# EAGLE design combined (EAGLE 8.6.0)

## Sheet 1 of 6
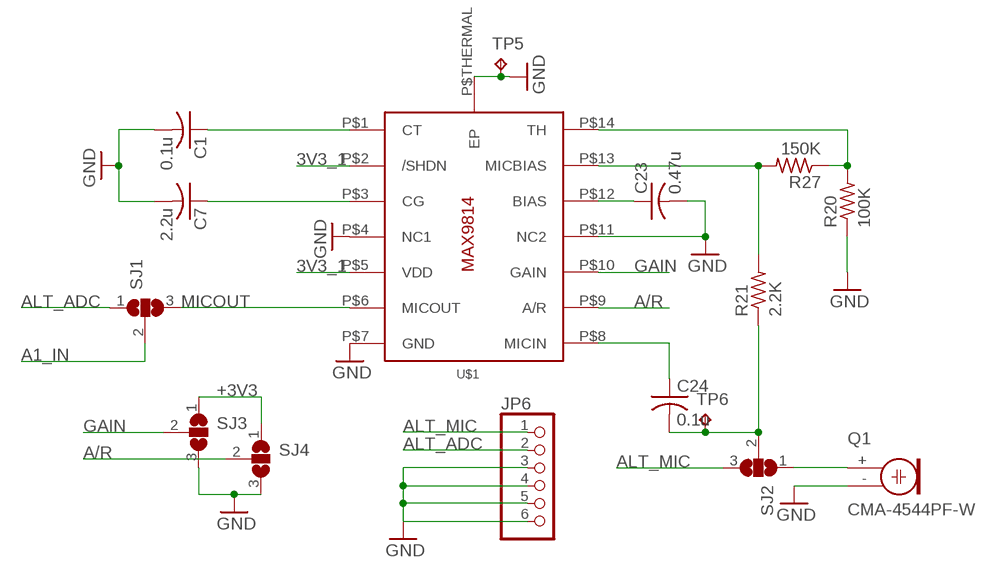
[diagram p0: schematic, sheet 1]

### Parts
C1  0.1u  C-USC0603  [C0603]
C7  2.2u  C-USC0603  [C0603]
C23  0.47u  C-USC0603  [C0603]
C24  0.1u  C-USC0603  [C0603]
JP6  PINHD-1X6  [1X06]
Q1  CMA-4544PF-W  ELECTRET  [9.7ELECTRET]
R20  100K  R-US_R0603  [R0603]
R21  2.2K  R-US_R0603  [R0603]
R27  150K  R-US_R0603  [R0603]
SJ1  SJ2W  [SJ_2]
SJ2  SJ2W  [SJ_2]
SJ3  SJ2W  [SJ_2]
SJ4  SJ2W  [SJ_2]
TP5  TPB1,27  [B1,27]
TP6  TPB1,27  [B1,27]
U$1  MAX9814TDFN14  [TDFN14_3X3MM]

### Nets
3V3_1: U$1.P$2(/SHDN) U$1.P$5(VDD)
+3V3: SJ3.1 SJ4.1 ; also sheet 3,4,5,6
A1_IN: SJ1.2 ; also sheet 3
A/R: SJ4.2 U$1.P$9(A/R)
ALT_ADC: JP6.2 SJ1.1
ALT_MIC: JP6.1
GAIN: SJ3.2 U$1.P$10(GAIN)
GND: C1.2 C7.2 C23.2 Q1.- R20.1 SJ3.3 SJ4.3 TP5.TP U$1.P$4(NC1) U$1.P$7(GND) U$1.P$11(NC2) U$1.P$THERMAL(EP) ; also sheet 2,3,4,5,6
INPUT: C24.2 R21.1 SJ2.2 TP6.TP
MICOUT: SJ1.3 U$1.P$6(MICOUT)
N$5: C24.1 U$1.P$8(MICIN)
N$7: C23.1 U$1.P$12(BIAS)
N$8: C1.1 U$1.P$1(CT)
N$9: C7.1 U$1.P$3(CG)
N$10: R20.2 R27.1 U$1.P$14(TH)
N$11: R21.2 R27.2 U$1.P$13(MICBIAS)
N$33: Q1.+ SJ2.1
N$47: JP6.3 JP6.4 JP6.5 JP6.6
Unconnected: SJ2.3

## Sheet 2 of 6
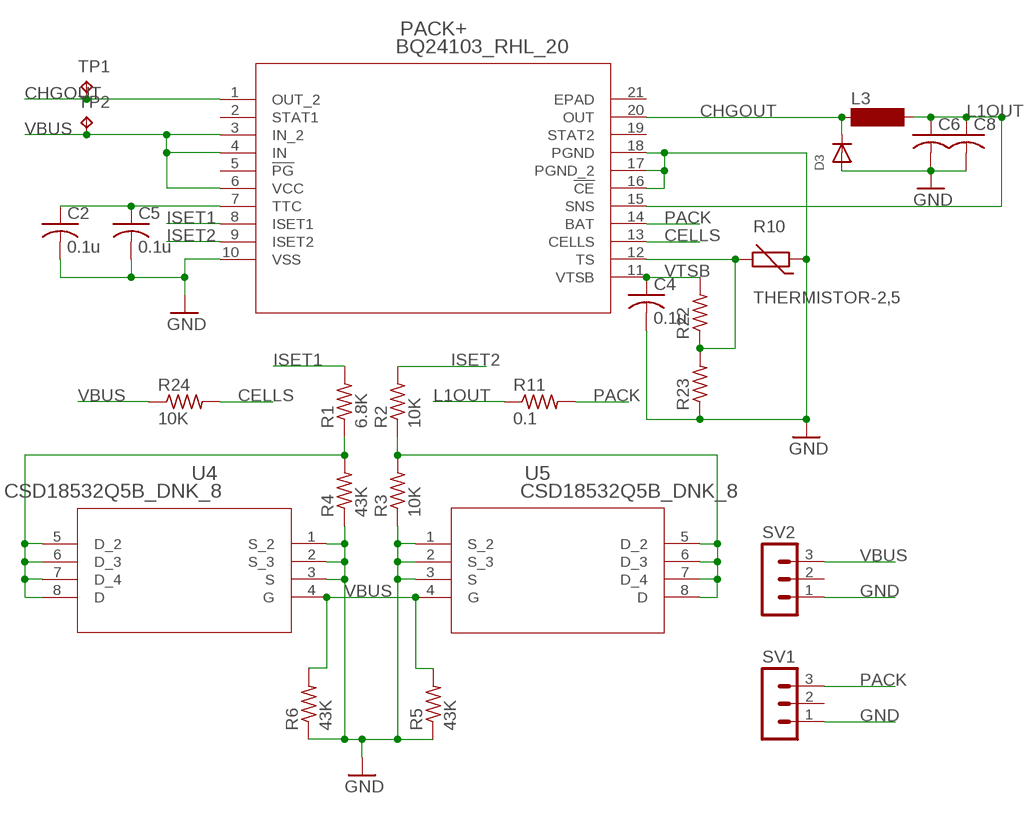
[diagram p1: schematic, sheet 2]

### Parts
C2  0.1u  C-USC0603  [C0603]
C4  0.1u  C-USC0603  [C0603]
C5  0.1u  C-USC0603  [C0603]
C6  C-USC0805K  [C0805K]
C8  C-USC0805K  [C0805K]
D3  DIODESOD-323F  [SOD-323F]
L3  MS85  [MS85]
PACK+  BQ24103_RHL_20  [RHL20_2P05X3P05]
R1  6.8K  R-US_R0603  [R0603]
R2  10K  R-US_R0603  [R0603]
R3  10K  R-US_R0603  [R0603]
R4  43K  R-US_R0603  [R0603]
R5  43K  R-US_R0603  [R0603]
R6  43K  R-US_R0603  [R0603]
R10  THERMISTOR-2,5  [RS-2,5]
R11  0.1  R-US_R0805  [R0805]
R22  R-US_R0805  [R0805]
R23  R-US_R0805  [R0805]
R24  10K  R-US_R0805  [R0805]
SV1  MA03-1  [MA03-1]
SV2  MA03-1  [MA03-1]
TP1  TPB1,27  [B1,27]
TP2  TPB1,27  [B1,27]
U4  CSD18532Q5B_DNK_8  [DNK8]
U5  CSD18532Q5B_DNK_8  [DNK8]

### Nets
CELLS: PACK+.13(CELLS) R24.2
CHGOUT: D3.C L3.1 PACK+.1(OUT_2) PACK+.20(OUT) TP1.TP
GND: C2.2 C4.2 C5.2 C6.2 C8.2 D3.A PACK+.10(VSS) PACK+.16(!CE) PACK+.17(PGND_2) PACK+.18(PGND) R3.1 R4.1 R5.1 R6.1 R10.1 R23.1 SV1.1 SV2.1 U4.1(S_2) U4.2(S_3) U4.3(S) U5.1(S_2) U5.2(S_3) U5.3(S) ; also sheet 1,3,4,5,6
ISET1: PACK+.8(ISET1) R1.2
ISET2: PACK+.9(ISET2) R2.2
L1OUT: C6.1 C8.1 L3.2 PACK+.15(SNS) R11.1
N$22: C2.1 C5.1 PACK+.7(TTC)
N$23: PACK+.12(TS) R10.2 R22.1 R23.2
N$24: R1.1 R4.2 U4.5(D_2) U4.6(D_3) U4.7(D_4) U4.8(D)
N$26: R2.1 R3.2 U5.5(D_2) U5.6(D_3) U5.7(D_4) U5.8(D)
PACK: PACK+.14(BAT) R11.2 SV1.3 ; also sheet 6
VBUS: PACK+.3(IN_2) PACK+.4(IN) PACK+.6(VCC) R5.2 R6.2 R24.1 SV2.3 TP2.TP U4.4(G) U5.4(G) ; also sheet 4
VTSB: C4.1 PACK+.11(VTSB) R22.2
Unconnected: PACK+.2(STAT1) PACK+.5(!PG) PACK+.19(STAT2) PACK+.21(EPAD) SV1.2 SV2.2

## Sheet 3 of 6
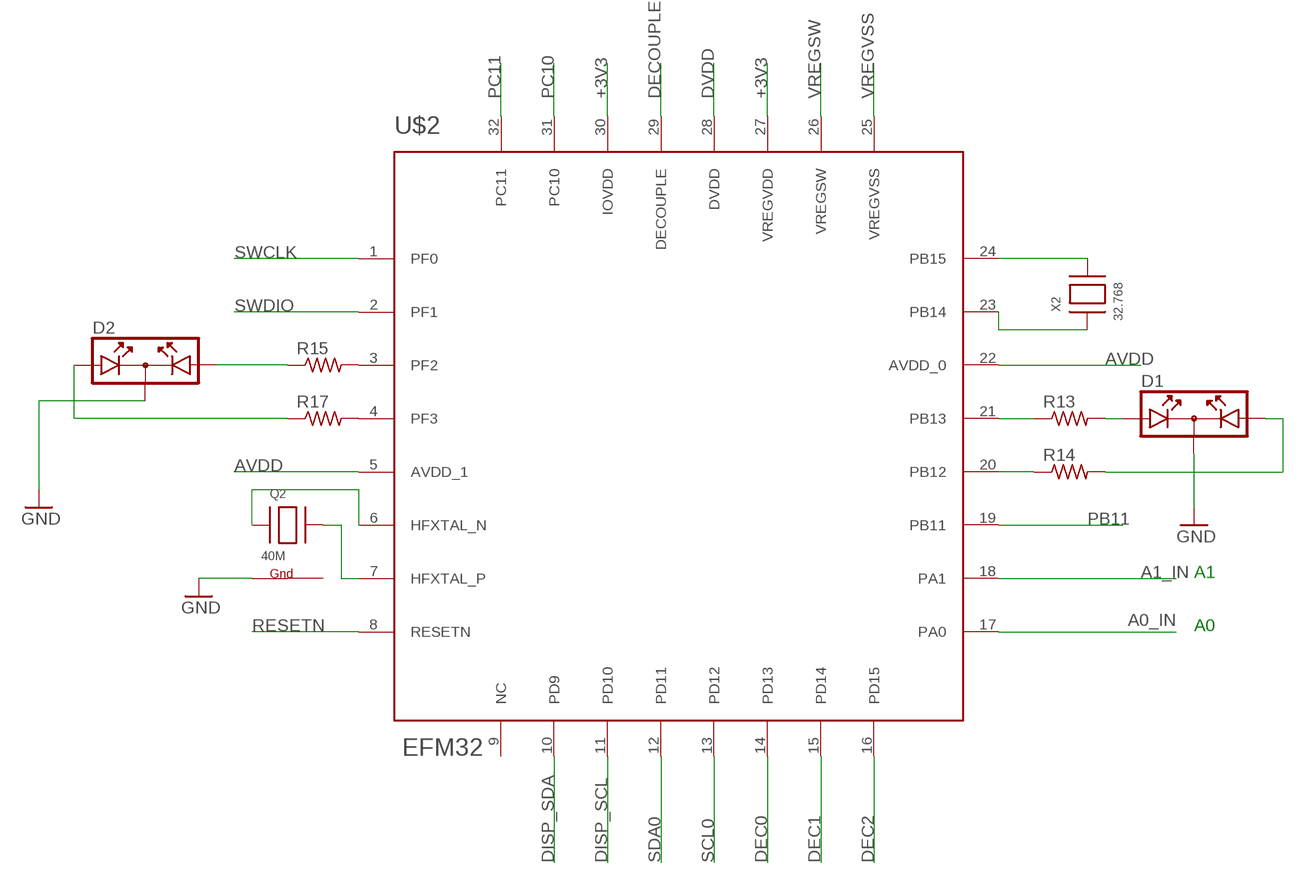
[diagram p2: schematic, sheet 3]

### Parts
D1  DUOLED  [DUOLED]
D2  DUOLED  [DUOLED]
Q2  40M  XTAL-4-3225  [NX3225]
R13  R-US_M0805  [M0805]
R14  R-US_M0805  [M0805]
R15  R-US_M0805  [M0805]
R17  R-US_M0805  [M0805]
U$2  EFM32  [QFN32]
X2  32.768  XTAL-3.2X1.5  [XTAL3215]

### Nets
+3V3: U$2.27(VREGVDD) U$2.30(IOVDD) ; also sheet 1,4,5,6
A0_IN: U$2.17(PA0)
A1_IN: U$2.18(PA1) ; also sheet 1
AVDD: U$2.5(AVDD_1) U$2.22(AVDD_0) ; also sheet 5
DEC0: U$2.14(PD13) ; also sheet 4
DEC1: U$2.15(PD14) ; also sheet 4
DEC2: U$2.16(PD15) ; also sheet 4
DECOUPLE: U$2.29(DECOUPLE) ; also sheet 5
DISP_SCL: U$2.11(PD10) ; also sheet 4
DISP_SDA: U$2.10(PD9) ; also sheet 4
DVDD: U$2.28(DVDD) ; also sheet 5
GND: D1.K D2.K Q2.4(G1) ; also sheet 1,2,4,5,6
N$32: Q2.1(X1) U$2.6(HFXTAL_N)
N$34: Q2.3(X2) U$2.7(HFXTAL_P)
N$35: U$2.24(PB15) X2.P$2
N$36: U$2.23(PB14) X2.P$1
N$37: D1.A1 R13.2
N$38: D1.A2 R14.2
N$40: R15.2 U$2.3(PF2)
N$41: D2.A2 R15.1
N$42: R17.2 U$2.4(PF3)
N$43: D2.A1 R17.1
N$44: R14.1 U$2.20(PB12)
N$45: R13.1 U$2.21(PB13)
PB11: U$2.19(PB11) ; also sheet 4,6
PC10: U$2.31(PC10) ; also sheet 4
PC11: U$2.32(PC11) ; also sheet 4
RESETN: U$2.8(RESETN)
SCL0: U$2.13(PD12) ; also sheet 4
SDA0: U$2.12(PD11) ; also sheet 4
SWCLK: U$2.1(PF0) ; also sheet 4
SWDIO: U$2.2(PF1) ; also sheet 4
VREGSW: U$2.26(VREGSW) ; also sheet 5
VREGVSS: U$2.25(VREGVSS)
Unconnected: U$2.9(NC)

### Notes on the sheet
- A1
- A0

## Sheet 4 of 6
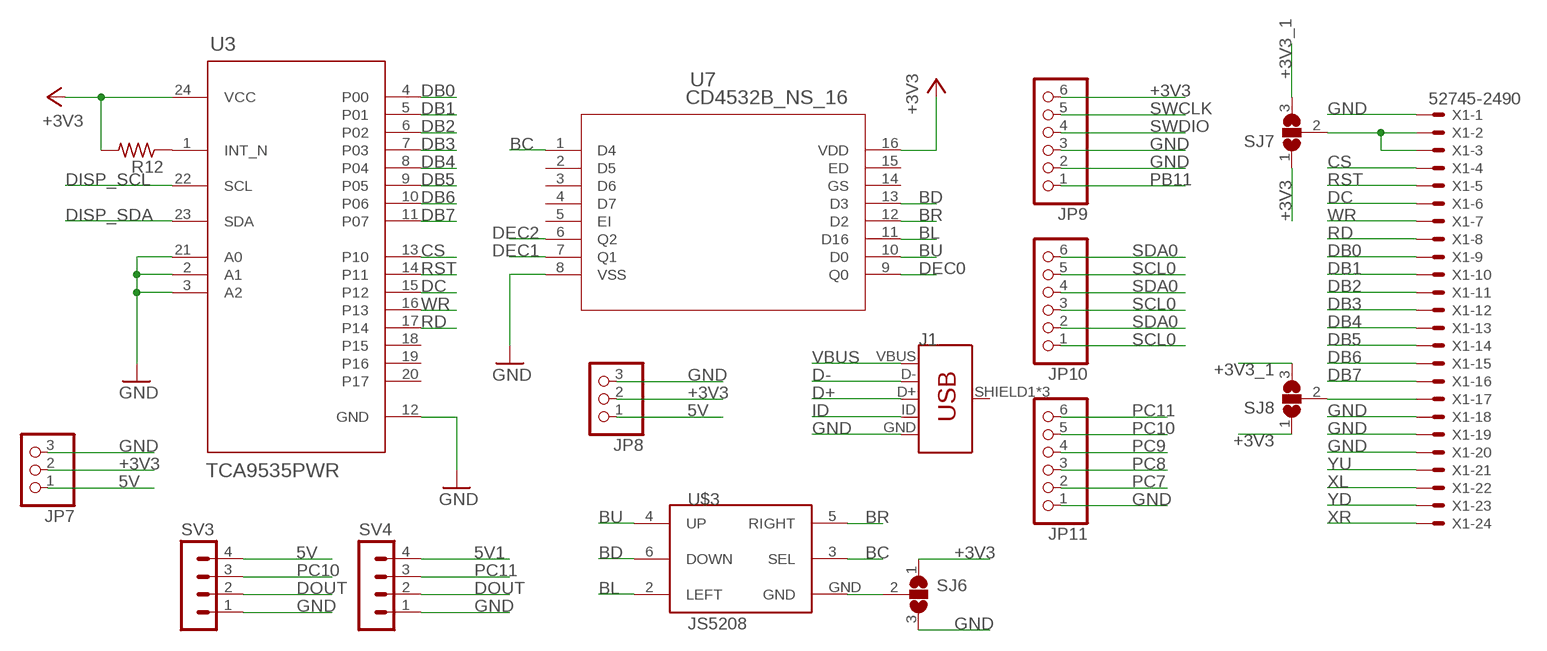
[diagram p3: schematic, sheet 4]

### Parts
J1  USB_MICRO-B_FEMALE-SMT  [USB-B-MICRO-SMD]
JP7  PINHD-1X3  [1X03]
JP8  PINHD-1X3  [1X03]
JP9  PINHD-1X6  [1X06]
JP10  PINHD-1X6  [1X06]
JP11  PINHD-1X6  [1X06]
R12  R-US_M0805  [M0805]
SJ6  SJ2W  [SJ_2]
SJ7  SJ2W  [SJ_2]
SJ8  SJ2W  [SJ_2]
SV3  MA04-1  [MA04-1]
SV4  MA04-1  [MA04-1]
U3  TCA9535PWR  [PW0024A_N]
U7  CD4532B_NS_16  [NS16]
U$3  JS5208  [JS5208]
X1  52745-2490  [52745-2490]

### Nets
5V: JP7.1 JP8.1 SV3.4 ; also sheet 6
5V1: SV4.4 ; also sheet 6
+3V3: JP7.2 JP8.2 JP9.6 R12.2 SJ6.1 SJ7.1 SJ8.1 U3.24(VCC) U7.16(VDD) ; also sheet 1,3,5,6
+3V3_1: SJ7.3 SJ8.3 ; also sheet 6
BC: U7.1(D4) U$3.3(SEL)
BD: U7.13(D3) U$3.6(DOWN)
BL: U7.11(D16) U$3.2(LEFT)
BR: U7.12(D2) U$3.5(RIGHT)
BU: U7.10(D0) U$3.4(UP)
CS: U3.13(P10) X1.4
D+: J1.D+
D-: J1.D-
DB0: U3.4(P00) X1.9
DB1: U3.5(P01) X1.10
DB2: U3.6(P02) X1.11
DB3: U3.7(P03) X1.12
DB4: U3.8(P04) X1.13
DB5: U3.9(P05) X1.14
DB6: U3.10(P06) X1.15
DB7: U3.11(P07) X1.16
DC: U3.15(P12) X1.6
DEC0: U7.9(Q0) ; also sheet 3
DEC1: U7.7(Q1) ; also sheet 3
DEC2: U7.6(Q2) ; also sheet 3
DISP_SCL: U3.22(SCL) ; also sheet 3
DISP_SDA: U3.23(SDA) ; also sheet 3
DOUT: SV3.2 SV4.2
GND: J1.GND JP7.3 JP8.3 JP9.2 JP9.3 JP11.1 SJ6.3 SV3.1 SV4.1 U3.2(A1) U3.3(A2) U3.12(GND) U3.21(A0) U7.8(VSS) X1.1 X1.18 X1.19 X1.20 ; also sheet 1,2,3,5,6
ID: J1.ID
N$1: SJ7.2 X1.2 X1.3
N$6: SJ8.2 X1.17
N$16: SJ6.2 U$3.GND
N$46: R12.1 U3.1(INT_N)
PB11: JP9.1 ; also sheet 3,6
PC7: JP11.2
PC8: JP11.3
PC9: JP11.4
PC10: JP11.5 SV3.3 ; also sheet 3
PC11: JP11.6 SV4.3 ; also sheet 3
RD: U3.17(P14) X1.8
RST: U3.14(P11) X1.5
SCL0: JP10.1 JP10.3 JP10.5 ; also sheet 3
SDA0: JP10.2 JP10.4 JP10.6 ; also sheet 3
SWCLK: JP9.5 ; also sheet 3
SWDIO: JP9.4 ; also sheet 3
VBUS: J1.VBUS ; also sheet 2
WR: U3.16(P13) X1.7
XL: X1.22
XR: X1.24
YD: X1.23
YU: X1.21
Unconnected: J1.SHIELD1(SHIELD) J1.SHIELD2(SHIELD) J1.SHIELD3(SHIELD) U3.18(P15) U3.19(P16) U3.20(P17) U7.2(D5) U7.3(D6) U7.4(D7) U7.5(EI) U7.14(GS) U7.15(ED)

## Sheet 5 of 6
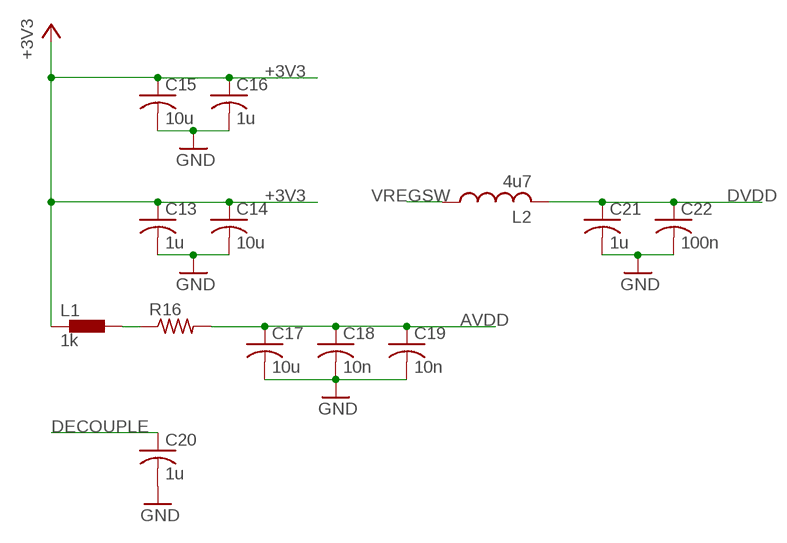
[diagram p4: schematic, sheet 5]

### Parts
C13  1u  C-USC0805  [C0805]
C14  10u  C-USC0805  [C0805]
C15  10u  C-USC0805  [C0805]
C16  1u  C-USC0805  [C0805]
C17  10u  C-USC0805  [C0805]
C18  10n  C-USC0805  [C0805]
C19  10n  C-USC0805  [C0805]
C20  1u  C-USC0805  [C0805]
C21  1u  C-USC0805  [C0805]
C22  100n  C-USC0805  [C0805]
L1  1k  BLM15HD102SN1  [0402]
L2  4u7  L-USL3225P  [L3225P]
R16  R-US_R0603  [R0603]

### Nets
+3V3: C13.1 C14.1 C15.1 C16.1 L1.1 ; also sheet 1,3,4,6
AVDD: C17.1 C18.1 C19.1 R16.2 ; also sheet 3
DECOUPLE: C20.1 ; also sheet 3
DVDD: C21.1 C22.1 L2.2 ; also sheet 3
GND: C13.2 C14.2 C15.2 C16.2 C17.2 C18.2 C19.2 C20.2 C21.2 C22.2 ; also sheet 1,2,3,4,6
N$2: L1.2 R16.1
VREGSW: L2.1 ; also sheet 3

## Sheet 6 of 6
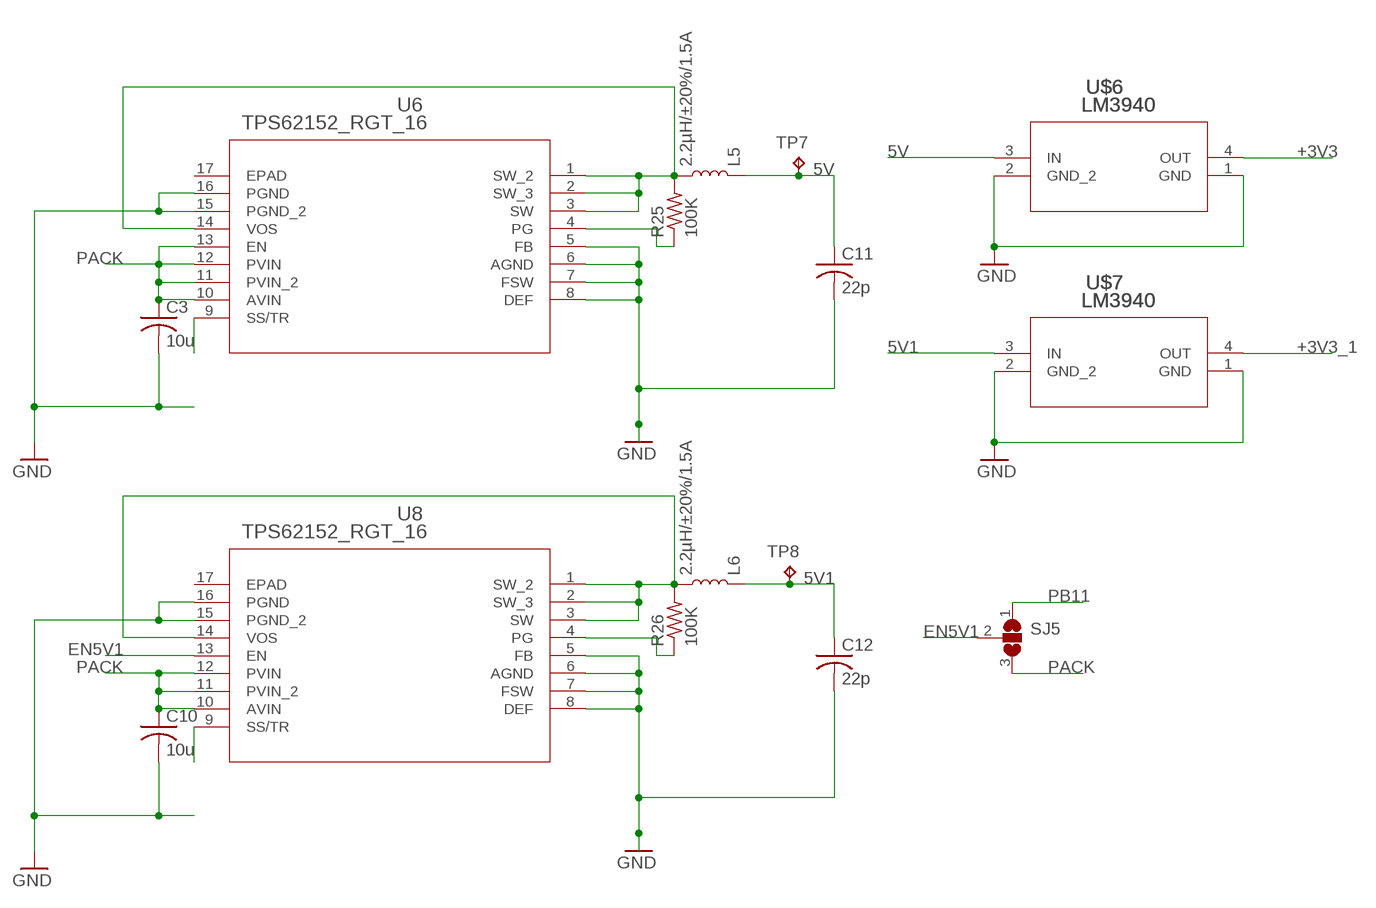
[diagram p5: schematic, sheet 6]

### Parts
C3  10u  C-USC0603K  [C0603K]
C10  10u  C-USC0603K  [C0603K]
C11  22p  C-USC0603K  [C0603K]
C12  22p  C-USC0603K  [C0603K]
L5  2.2µH/±20%/1.5A  INDUCTOR-VLF4012AT-2.2UH  [INDUCTOR_2.2UH]
L6  2.2µH/±20%/1.5A  INDUCTOR-VLF4012AT-2.2UH  [INDUCTOR_2.2UH]
R25  100K  R-US_R0603  [R0603]
R26  100K  R-US_R0603  [R0603]
SJ5  SJ2W  [SJ_2]
TP7  TPB1,27  [B1,27]
TP8  TPB1,27  [B1,27]
U6  TPS62152_RGT_16  [RGT16_1P7X1P7]
U8  TPS62152_RGT_16  [RGT16_1P7X1P7]
U$6  LM3940  [MP04A]
U$7  LM3940  [MP04A]

### Nets
5V: C11.1 L5.P$1 TP7.TP U$6.3(IN) ; also sheet 4
5V1: C12.1 L6.P$1 TP8.TP U$7.3(IN) ; also sheet 4
+3V3: U$6.4(OUT) ; also sheet 1,3,4,5
+3V3_1: U$7.4(OUT) ; also sheet 4
EN5V1: SJ5.2 U8.13(EN)
GND: C3.2 C10.2 C11.2 C12.2 U6.5(FB) U6.6(AGND) U6.7(FSW) U6.8(DEF) U6.15(PGND_2) U6.16(PGND) U8.5(FB) U8.6(AGND) U8.7(FSW) U8.8(DEF) U8.15(PGND_2) U8.16(PGND) U$6.1(GND) U$6.2(GND_2) U$7.1(GND) U$7.2(GND_2) ; also sheet 1,2,3,4,5
N$3: U8.9(SS/TR)
N$4: U6.9(SS/TR)
N$48: L5.P$2 R25.2 U6.1(SW_2) U6.2(SW_3) U6.3(SW) U6.14(VOS)
N$53: R25.1 U6.4(PG)
N$54: L6.P$2 R26.2 U8.1(SW_2) U8.2(SW_3) U8.3(SW) U8.14(VOS)
N$55: R26.1 U8.4(PG)
PACK: C3.1 C10.1 SJ5.3 U6.10(AVIN) U6.11(PVIN_2) U6.12(PVIN) U6.13(EN) U8.10(AVIN) U8.11(PVIN_2) U8.12(PVIN) ; also sheet 2
PB11: SJ5.1 ; also sheet 3,4
Unconnected: U6.17(EPAD) U8.17(EPAD)

## Power pins joined to a net without a drawn wire
G2: Q2.2(G2)

## Library data of the parts
C1-C8 C10-C24 = resistor:C-US: CAPACITOR, American symbol
D1 D2 = special:DUOLED: Duo LED
D3 = adafruit:DIODE: Diode SMADIODE - SMA Surface Mount Package 20V 1A Schottky Diode Digikey: 641-1014-6-ND DO-1N4148 - Through Hole Small Current Diode SOD-123 20V 1 A (.5mV Vf) Schottky Diode - Digikey: MBRX120TPMSCT-ND SOD-323 10V 570mA (.38mV Vf, 3ns) Schottky Diode - Digikey: ZLLS410CT-ND SOD-523 30V 30mA Schottky Diode (RB751S-40TE61) - Digikey: RB751S-40TE61CT-ND SOT23-R/W - SOT23 Package (R = Solder Paste/Reflow Ovens, W = Hand-Soldering) BAT54Film 40V 300mA - Digikey: 497-7162-1-ND
J1 = power_module:USB_MICRO-B: USB Type Micro-B Connector Male/female and PTH/SMT variants SparkFun Products: SparkFun microB USB Breakout <https://www.sparkfun.com/products/12035> SparkFun USB microB Plug Breakout <https://www.sparkfun.com/products/10031> SparkFun ESP8266 Thing <https://www.sparkfun.com/products/13231>; PROD_ID: CONN-11752
JP6 JP9-JP11 = adafruit:PINHD-1X6: PIN HEADER
JP7 JP8 = adafruit:PINHD-1X3: PIN HEADER
L1 = inductors:BLM15H: EMIFIL (R) Chip Ferrite Bead for GHz Noise Source: http://www.murata.com/ Ferrite Bead BLM15H.pdf
L2 = resistor:L-US: INDUCTOR, American symbol
L3 = inductor-neosid:MS85: INDUCTOR SMD power inductor; OC_FARNELL: unknown; OC_NEWARK: unknown
L5 L6 = power_module:INDUCTOR: Inductors Resist changes in electrical current. Basically a coil of wire. SparkFun Products: SparkFun Load Cell Amplifier - HX711 <https://www.sparkfun.com/products/13879> IOIO-OTG - V2.2 <https://www.sparkfun.com/products/13613>; PROD_ID: NDUC-09513
PACK+ = power_module:BQ24103_RHL_20
Q1 = adafruit:ELECTRET: Electret microphone Thru hole 2.54mm spacing with 9.7mm diameter
Q2 = adafruit:XTAL-4: Classic 4-pin 3.2 x 2.5mm crystal
R1-R6 R11 R16 R20-R27 = resistor:R-US_: RESISTOR, American symbol
R10 = varistor:THERMISTOR: THERMISTOR
R12-R15 R17 = adafruit:R-US_: RESISTOR, American symbol
SJ1-SJ8 = jumper:SJ2W: SMD solder JUMPER
SV1 SV2 = con-lstb:MA03-1: PIN HEADER; OC_FARNELL: unknown; OC_NEWARK: unknown
SV3 SV4 = con-lstb:MA04-1: PIN HEADER; OC_FARNELL: unknown; OC_NEWARK: unknown
TP1 TP2 TP5-TP8 = testpad:TP: Test pad
U3 = power_module:TCA9535PWR
U4 U5 = power_module:CSD18532Q5B_DNK_8; MANUFACTURER_PART_NUMBER: csd18532q5b_dnk_8; VENDOR: TEXAS INSTRUMENTS
U6 U8 = power_module:TPS62152_RGT_16; MANUFACTURER_PART_NUMBER: tps62152_rgt_16; VENDOR: Texas Instruments
U7 = power_module:CD4532B_NS_16
U$1 = adafruit:MAX9814
U$2 = QFN32:EFM32
U$3 = power_module:JS5208
U$6 U$7 = power_module:LM3940
X1 = con-molex:52745-2490: FFC/FPC-to-Board 0.50mm (.020") SMT Top Contact Right Angle, ZIF, Style Receptacle 52745 / 52435 Source: http://www.molex.com/product/ffc/52745.html; MF: MOLEX; OC_FARNELL: unknown; OC_NEWARK: unknown
X2 = adafruit:XTAL: Low cost SMT crystals, no capacitors included http://www.ladyada.net/library/eagle

## Board
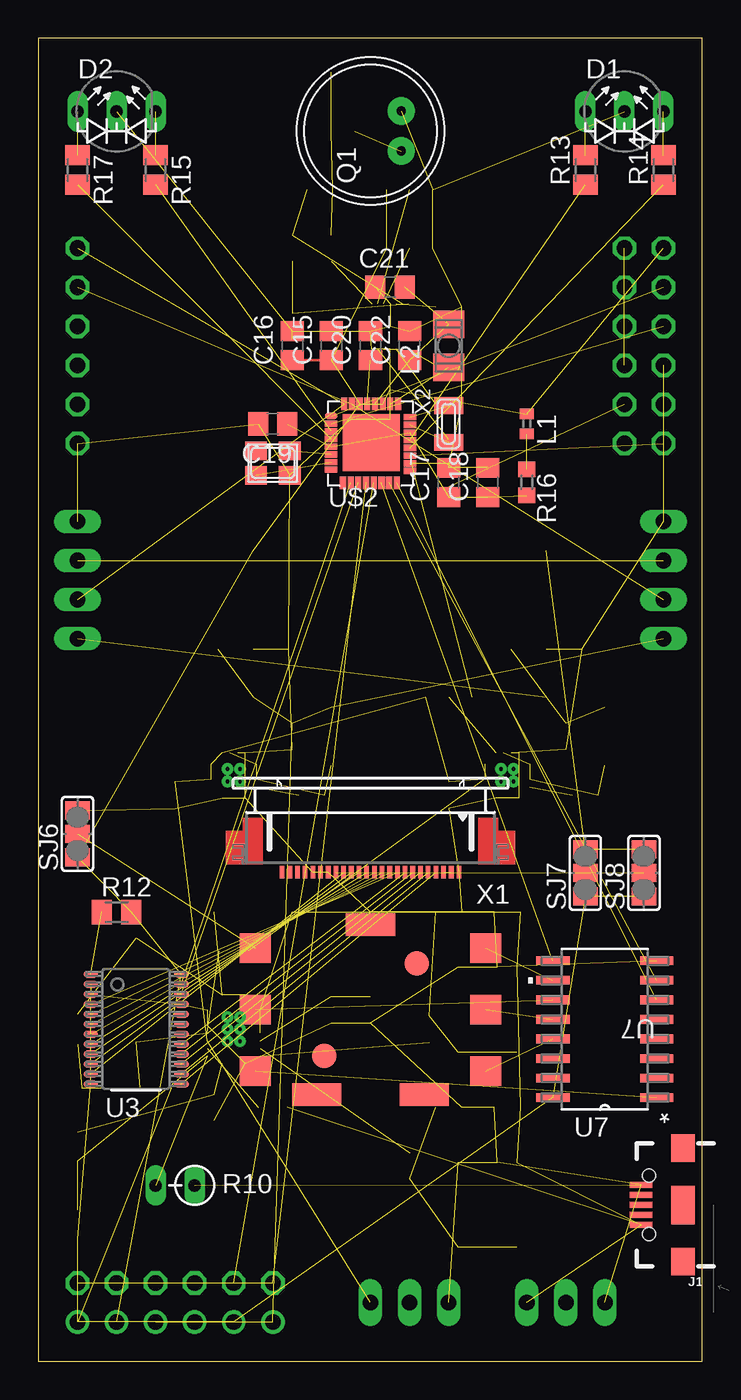
[diagram p6: board, top side]
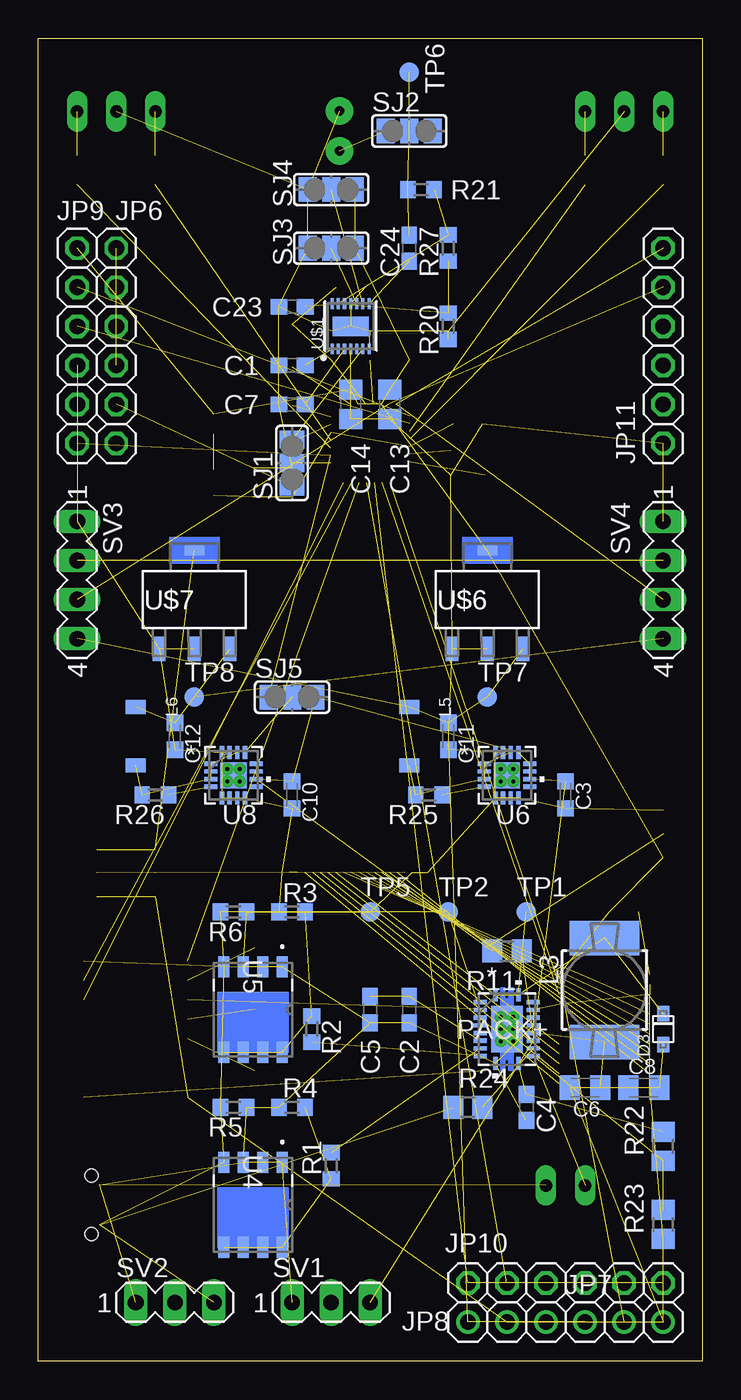
[diagram p7: board, bottom side, seen from below]

Size 43.16 x 86.03 mm. Coordinates in mm from the lower left corner, seen from the top.
Outline: 0,0 43.16,0 43.16,86.03 0,86.03 0,0
Copper layers (1*16): Top 0.035mm / dielectric 1.5mm / Bottom 0.035mm
Design rules "default": minimum track width 6mil, minimum drill 0.35mm, track to track 6mil, track to pad 6mil, pad to pad 6mil, via to via 6mil, smd to smd 6mil, copper to edge 40mil, drill to drill 6mil, minimum pad ring 10mil, minimum via ring 8mil, stop-mask expansion 4mil, vias tented up to drill 0mil, thermal gap 10mil

### Footprints (pad centres in the part's own frame; a part is rotated, then mirrored left to right if it is on the bottom)
C0603 = smd 1.1 x 1: 1 -0.85,0; 2 0.85,0
C0603K = smd 1.05 x 1.08: 1 -0.875,0; 2 0.875,0
C0805K = smd 1.3 x 1.6: 1 -1,0; 2 1,0
C0805 = smd 1.3 x 1.5: 1 -0.95,0; 2 0.95,0
DUOLED = drill 0.813 long: A1 -3.81,0; A2 1.27,0; K -1.27,0
SOD-323F = smd 1 x 0.8: A -1,0; C 1,0
USB-B-MICRO-SMD = smd 1.45 x 0.4: D+ 2.725,0; D- 2.725,0.65; GND 2.725,-1.3; ID 2.725,-0.65; VBUS 2.725,1.3 | smd 1.5 x 1.8: SHIELD1 0,3.685; SHIELD2 0,-3.685 | smd 1.5 x 2.5: SHIELD3 0,0 | hole 0.85: 2.2,1.9; 2.2,-1.9
1X06 = drill 1.016 octagon: 1 -6.35,0; 2 -3.81,0; 3 -1.27,0; 4 1.27,0; 5 3.81,0; 6 6.35,0
1X03 = drill 1.016: 1 -2.54,0; 2 0,0; 3 2.54,0
0402 = smd 0.7 x 0.9: 1 -0.65,0; 2 0.65,0
L3225P = smd 1.8 x 2: 1 -1.4,0; 2 1.4,0
MS85 = smd 4.5 x 2.25: 1 0,-3.383; 2 0,3.383
INDUCTOR_2.2UH = smd 0.9 x 1.3: P$1 -1.9,0; P$2 1.9,0
RHL20_2P05X3P05 = smd 0.28 x 0.85: 1 -0.75,2.225; 10 -0.75,-2.225; 11 0.75,-2.225; 20 0.75,2.225 | smd 0.85 x 0.28: 2 -1.725,1.75; 3 -1.725,1.25; 4 -1.725,0.75; 5 -1.725,0.25; 6 -1.725,-0.25; 7 -1.725,-0.75; 8 -1.725,-1.25; 9 -1.725,-1.75; 12 1.725,-1.75; 13 1.725,-1.25; 14 1.725,-0.75; 15 1.725,-0.25; 16 1.725,0.25; 17 1.725,0.75; 18 1.725,1.25; 19 1.725,1.75 | smd 2.05 x 3.05: 21 0,0 | drill 0.254 pad 0.508: V -0.406,-0.787; V_1 -0.406,0; V_2 -0.406,0.787; V_3 0.406,-0.787; V_4 0.406,0; V_5 0.406,0.787
9.7ELECTRET = drill 0.6 pad 1.778: + 1.3,2; - -1.3,2
NX3225 = smd 1.4 x 1.2: 1 -1.1,-0.8; 2 1.1,-0.8; 3 1.1,0.8; 4 -1.1,0.8
R0603 = smd 1 x 1.1: 1 -0.85,0; 2 0.85,0
RS-2,5 = drill 0.813 long: 1 -1.27,0; 2 1.27,0
R0805 = smd 1.3 x 1.5: 1 -0.95,0; 2 0.95,0
M0805 = smd 1.3 x 1.6: 1 -0.95,0; 2 0.95,0
SJ_2 = smd 1.168 x 1.6: 1 -1.524,0; 2 0,0; 3 1.524,0
MA03-1 = drill 1.016 long: 1 -2.54,0; 2 0,0; 3 2.54,0
MA04-1 = drill 1.016 long: 1 -3.81,0; 2 -1.27,0; 3 1.27,0; 4 3.81,0
B1,27 = smd 1.27 x 1.27: TP 0,0
PW0024A_N = smd 0.95 x 0.45: 1 -2.95,3.575; 2 -2.95,2.925; 3 -2.95,2.275; 4 -2.95,1.625; 5 -2.95,0.975; 6 -2.95,0.325; 7 -2.95,-0.325; 8 -2.95,-0.975; 9 -2.95,-1.625; 10 -2.95,-2.275; 11 -2.95,-2.925; 12 -2.95,-3.575; 13 2.95,-3.575; 14 2.95,-2.925; 15 2.95,-2.275; 16 2.95,-1.625; 17 2.95,-0.975; 18 2.95,-0.325; 19 2.95,0.325; 20 2.95,0.975; 21 2.95,1.625; 22 2.95,2.275; 23 2.95,2.925; 24 2.95,3.575
DNK8 = smd 1.372 x 0.71: 1 -2.77,1.905; 2 -2.77,0.635; 3 -2.77,-0.635; 4 -2.77,-1.905; 5 2.77,-1.905; 6 2.77,-0.635; 7 2.77,0.635; 8 2.77,1.905
RGT16_1P7X1P7 = smd 0.85 x 0.28: 1 -1.475,0.75; 2 -1.475,0.25; 3 -1.475,-0.25; 4 -1.475,-0.75; 9 1.475,-0.75; 10 1.475,-0.25; 11 1.475,0.25; 12 1.475,0.75 | smd 0.28 x 0.85: 5 -0.75,-1.475; 6 -0.25,-1.475; 7 0.25,-1.475; 8 0.75,-1.475; 13 0.75,1.475; 14 0.25,1.475; 15 -0.25,1.475; 16 -0.75,1.475 | smd 1.7 x 1.7: 17 0,0 | drill 0.254 pad 0.508: V -0.406,-0.406; V_1 -0.406,0.406; V_2 0.406,-0.406; V_3 0.406,0.406
NS16 = smd 2.159 x 0.559: 1 -3.378,4.445; 2 -3.378,3.175; 3 -3.378,1.905; 4 -3.378,0.635; 5 -3.378,-0.635; 6 -3.378,-1.905; 7 -3.378,-3.175; 8 -3.378,-4.445; 9 3.378,-4.445; 10 3.378,-3.175; 11 3.378,-1.905; 12 3.378,-0.635; 13 3.378,0.635; 14 3.378,1.905; 15 3.378,3.175; 16 3.378,4.445
TDFN14_3X3MM = smd 0.7 x 0.2: P$1 -1.475,1.2; P$2 -1.475,0.8; P$3 -1.475,0.4; P$4 -1.475,0; P$5 -1.475,-0.4; P$6 -1.475,-0.8; P$7 -1.475,-1.2; P$8 1.475,-1.2; P$9 1.475,-0.8; P$10 1.475,-0.4; P$11 1.475,0; P$12 1.475,0.4; P$13 1.475,0.8; P$14 1.475,1.2 | smd 1.27 x 2.35: P$THERMAL 0,0
QFN32 = smd 0.813 x 0.406: 1 -2.56,1.79; 2 -2.56,1.29; 3 -2.56,0.79; 4 -2.56,0.29; 5 -2.56,-0.21; 6 -2.56,-0.71; 7 -2.56,-1.21; 8 -2.56,-1.71; 17 2.56,-1.79; 18 2.56,-1.29; 19 2.56,-0.79; 20 2.56,-0.29; 21 2.56,0.21; 22 2.56,0.71; 23 2.56,1.21; 24 2.56,1.71 | smd 0.406 x 0.813: 9 -1.79,-2.56; 10 -1.29,-2.56; 11 -0.79,-2.56; 12 -0.29,-2.56; 13 0.21,-2.56; 14 0.71,-2.56; 15 1.21,-2.56; 16 1.71,-2.56; 25 1.79,2.56; 26 1.29,2.56; 27 0.79,2.56; 28 0.29,2.56; 29 -0.21,2.56; 30 -0.71,2.56; 31 -1.21,2.56; 32 -1.71,2.56 | smd 3.7 x 3.7: HEATSINK 0.04,0.06
JS5208 = smd 2 x 1.9: 2 -7.5,0; 3 -7.5,-4; 4 7.5,4; 5 7.5,0; 6 7.5,-4; GND -7.5,4 | smd 3.2 x 1.45: P$7 -3.5,-5.525; P$8 3.5,-5.525; P$9 0,5.525 | smd 1.6 x 1.6: P$10 -3,-3; P$11 3,3
MP04A = smd 0.838 x 1.6: 1 -2.3,-3.2; 2 0,-3.2; 3 2.3,-3.2 | smd 1.27 x 0.635: 4 0,3.175
52745-2490 = smd 0.3 x 0.8: 1 -5.75,2.5; 2 -5.25,2.5; 3 -4.75,2.5; 4 -4.25,2.5; 5 -3.75,2.5; 6 -3.25,2.5; 7 -2.75,2.5; 8 -2.25,2.5; 9 -1.75,2.5; 10 -1.25,2.5; 11 -0.75,2.5; 12 -0.25,2.5; 13 0.25,2.5; 14 0.75,2.5; 15 1.25,2.5; 16 1.75,2.5; 17 2.25,2.5; 18 2.75,2.5; 19 3.25,2.5; 20 3.75,2.5; 21 4.25,2.5; 22 4.75,2.5; 23 5.25,2.5; 24 5.75,2.5
XTAL3215 = smd 1.1 x 1.9: P$1 1.2,0; P$2 -1.2,0

### Placement (x,y rotation side)
C1  26.67,64.77 180 bottom
C2  19.05,22.86 270 bottom
C3  8.89,36.83 270 bottom
C4  11.43,16.51 270 bottom
C5  21.59,22.86 270 bottom
C6  7.62,17.78 180 bottom
C7  26.67,62.23 180 bottom
C8  3.81,17.78 0 bottom
C10  26.67,36.83 270 bottom
C11  16.51,40.64 270 bottom
C12  34.29,40.64 270 bottom
C13  20.32,62.23 270 bottom
C14  22.86,62.23 270 bottom
C15  19.05,66.04 90 top
C16  16.51,66.04 90 top
C17  26.67,57.15 90 top
C18  29.21,57.15 90 top
C19  15.24,60.96 180 top
C20  21.59,66.04 90 top
C21  22.86,69.85 180 top
C22  24.13,66.04 90 top
C23  26.67,68.58 180 bottom
C24  19.05,72.39 90 bottom
D1  39.37,81.28 0 top
D2  6.35,81.28 0 top
D3  2.54,21.59 90 bottom
J1  41.91,10.16 180 top
JP6  38.1,66.04 90 bottom
JP7  5.08,2.54 0 bottom
JP8  12.7,2.54 0 bottom
JP9  40.64,66.04 90 bottom
JP10  8.89,5.08 180 bottom
JP11  2.54,66.04 90 bottom
L1  31.75,60.96 270 top
L2  26.67,66.04 90 top
L3  6.35,24.13 180 bottom
L5  19.05,40.64 270 bottom
L6  36.83,40.64 270 bottom
PACK+  12.7,21.59 0 bottom
Q1  21.59,80.01 270 top
Q2  15.24,58.42 180 top
R1  24.13,12.7 90 bottom
R2  25.4,21.59 270 bottom
R3  26.67,29.21 0 bottom
R4  26.67,16.51 0 bottom
R5  30.48,16.51 180 bottom
R6  30.48,29.21 180 bottom
R10  8.89,11.43 180 top
R11  12.7,26.67 180 bottom
R12  5.08,29.21 0 top
R13  35.56,77.47 90 top
R14  40.64,77.47 90 top
R15  7.62,77.47 270 top
R16  31.75,57.15 270 top
R17  2.54,77.47 270 top
R20  16.51,67.31 90 bottom
R21  18.29,76.2 0 bottom
R22  2.54,13.97 90 bottom
R23  2.54,8.89 90 bottom
R24  15.24,16.51 0 bottom
R25  17.78,36.83 180 bottom
R26  35.56,36.83 180 bottom
R27  16.51,72.39 90 bottom
SJ1  26.67,58.42 90 bottom
SJ2  19.05,80.01 0 bottom
SJ3  24.13,72.39 180 bottom
SJ4  24.13,76.2 180 bottom
SJ5  26.67,43.18 0 bottom
SJ6  2.54,34.29 90 top
SJ7  35.56,31.75 90 top
SJ8  39.37,31.75 90 top
SV1  24.13,3.81 0 bottom
SV2  34.29,3.81 0 bottom
SV3  40.64,50.8 270 bottom
SV4  2.54,50.8 270 bottom
TP1  11.43,29.21 0 bottom
TP2  16.51,29.21 0 bottom
TP5  21.59,29.21 0 bottom
TP6  19.05,83.82 270 bottom
TP7  13.97,43.18 0 bottom
TP8  33.02,43.18 0 bottom
U3  6.35,21.59 0 top
U4  29.21,10.16 270 bottom
U5  29.21,22.86 270 bottom
U6  12.7,38.1 0 bottom
U7  36.83,21.59 180 top
U8  30.48,38.1 0 bottom
U$1  22.86,67.31 90 bottom
U$2  21.59,59.69 0 top
U$3  21.59,22.86 0 top
U$6  13.97,49.53 0 bottom
U$7  33.02,49.53 0 bottom
X1  21.59,34.29 180 top
X2  26.67,60.96 270 top

### Tracks (layer width: path | path; a pad name or v marks a point on that pad's centre or on a via)
3V3_1  (1 unrouted)
5V  (6 unrouted)
5V1  (4 unrouted)
+3V3  (17 unrouted)
  Top 0.152: C16.1 C15.1
+3V3_1  (2 unrouted)
A1_IN  (1 unrouted)
A/R  (1 unrouted)
ALT_ADC  (1 unrouted)
AVDD  (5 unrouted)
BC  (1 unrouted)
BD  (1 unrouted)
BL  (1 unrouted)
BR  (1 unrouted)
BU  (1 unrouted)
CELLS  (1 unrouted)
CHGOUT  (4 unrouted)
CS  (1 unrouted)
DB0  (1 unrouted)
DB1  (1 unrouted)
DB2  (1 unrouted)
DB3  (1 unrouted)
DB4  (1 unrouted)
DB5  (1 unrouted)
DB6  (1 unrouted)
DB7  (1 unrouted)
DC  (1 unrouted)
DEC0  (1 unrouted)
DEC1  (1 unrouted)
DEC2  (1 unrouted)
DECOUPLE  (1 unrouted)
DISP_SCL  (1 unrouted)
DISP_SDA  (1 unrouted)
DOUT  (1 unrouted)
DVDD  (3 unrouted)
EN5V1  (1 unrouted)
GAIN  (1 unrouted)
GND  (86 unrouted)
INPUT  (3 unrouted)
ISET1  (1 unrouted)
ISET2  (1 unrouted)
L1OUT  (4 unrouted)
MICOUT  (1 unrouted)
N$1  (2 unrouted)
N$2  (1 unrouted)
N$5  (1 unrouted)
N$6  (1 unrouted)
N$7  (1 unrouted)
N$8  (1 unrouted)
N$9  (1 unrouted)
N$10  (2 unrouted)
N$11  (2 unrouted)
N$16  (1 unrouted)
N$22  (2 unrouted)
N$23  (3 unrouted)
N$24  (5 unrouted)
N$26  (5 unrouted)
N$32  (1 unrouted)
N$33  (1 unrouted)
N$34  (1 unrouted)
N$35  (1 unrouted)
N$36  (1 unrouted)
N$37  (1 unrouted)
N$38  (1 unrouted)
N$40  (1 unrouted)
N$41  (1 unrouted)
N$42  (1 unrouted)
N$43  (1 unrouted)
N$44  (1 unrouted)
N$45  (1 unrouted)
N$46  (1 unrouted)
N$47  (3 unrouted)
N$48  (5 unrouted)
N$53  (1 unrouted)
N$54  (5 unrouted)
N$55  (1 unrouted)
PACK  (12 unrouted)
PB11  (2 unrouted)
PC10  (2 unrouted)
PC11  (2 unrouted)
RD  (1 unrouted)
RST  (1 unrouted)
SCL0  (3 unrouted)
SDA0  (3 unrouted)
SWCLK  (1 unrouted)
SWDIO  (1 unrouted)
VBUS  (10 unrouted)
VREGSW  (1 unrouted)
VTSB  (2 unrouted)
WR  (1 unrouted)